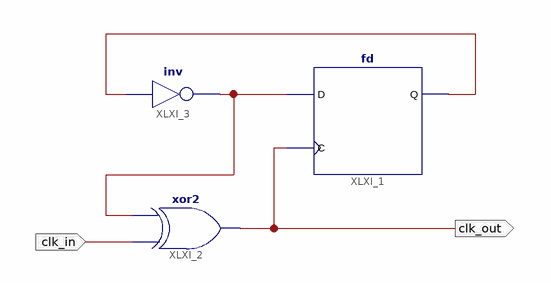
[diagram p0: schematic sheet 1]
// Xilinx ISE schematic freq_doubler.sch (xbr) as structural Verilog: 3 symbols, 2 ports
module freq_doubler (
  input  clk_in,
  output clk_out
);

  wire XLXN_5, XLXN_6;

  fd XLXI_1 (.C(clk_out), .D(XLXN_6), .Q(XLXN_5));
  xor XLXI_2 (clk_out, clk_in, XLXN_6);
  not XLXI_3 (XLXN_6, XLXN_5);
endmodule
